# EAGLE design PiButtons7 (EAGLE 6.4)
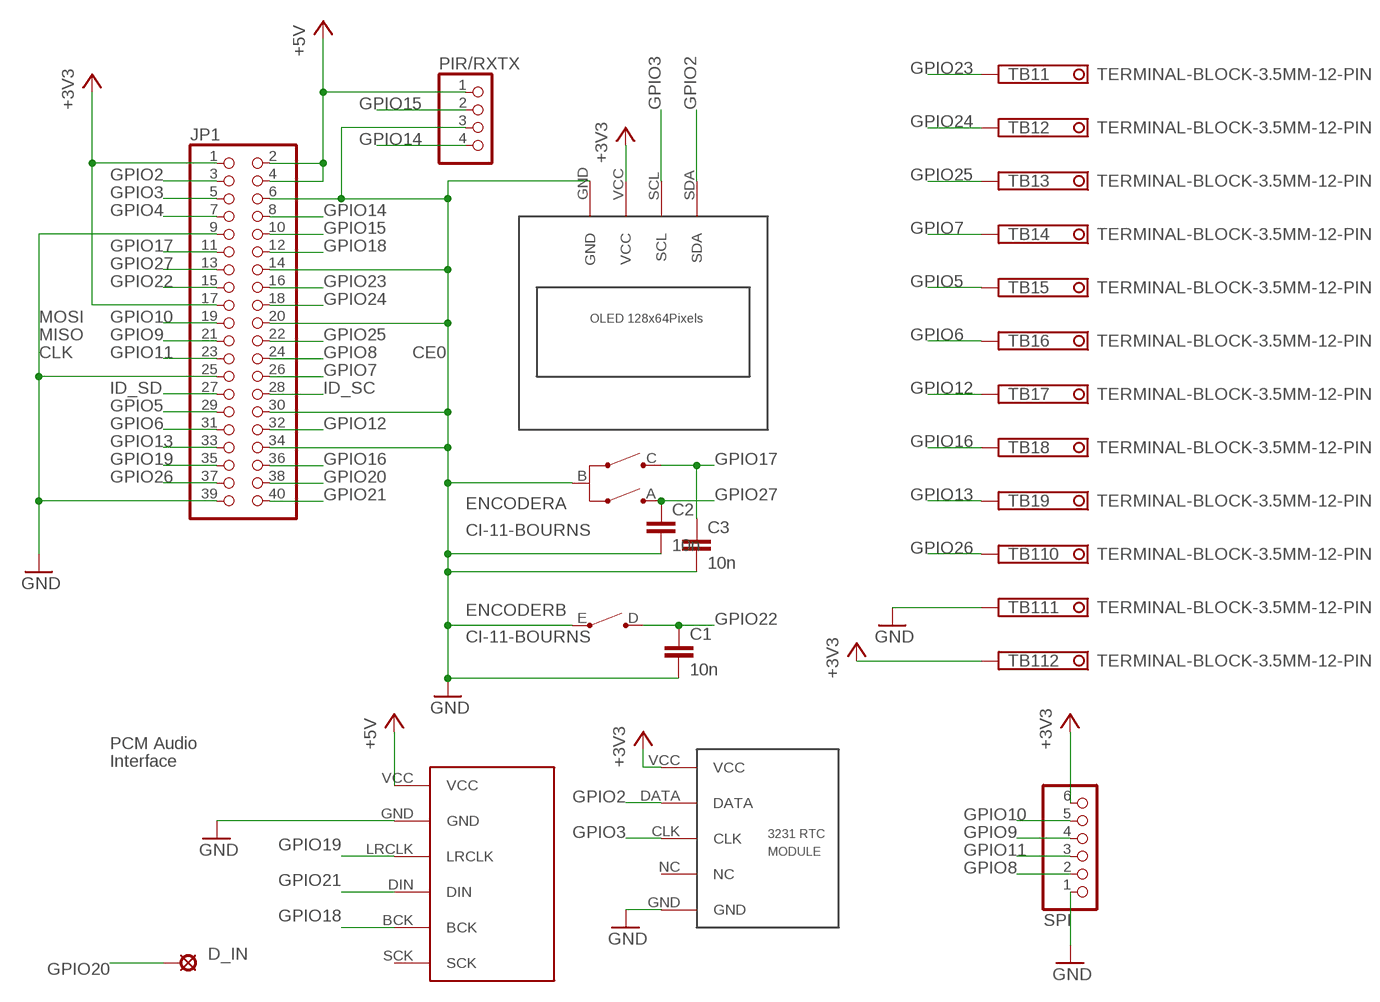
[diagram p0: schematic, sheet 1]

## Parts
C1  10n  C-EU050-025X075  [C050-025X075]
C2  10n  C-EU050-025X075  [C050-025X075]
C3  10n  C-EU050-025X075  [C050-025X075]
D_IN  LSP10  [LSP10]
ENCODER  CI-11-BOURNS  CI-11BOURNS  [CI-11]
JP1  PINHD-2X20  [2X20]
PIR/RXTX  PINHD-1X4  [1X04]
SPI  PINHD-1X6  [1X06]
TB1  TERMINAL-BLOCK-3.5MM-12-PIN  [TERMINAL-BLOCK-12-PIN-3.5MM-LONG-PAD]
U$1  PCM5102CARDPCB  [PCM5102CARD]
U$2  OLEDI2CDISPLAY  [OLEDI2C]
U$3  RTC3231PCB  [RTC3231PCB]

## Nets
+3V3: JP1.1 JP1.17 SPI.6 TB1.12 U$2.VCC U$3.VCC
+5V: JP1.2 JP1.4 PIR/RXTX.1 U$1.VCC
GND: C1.2 C2.2 C3.2 ENCODER.B(A:C) ENCODER.E(B:E) JP1.6 JP1.9 JP1.14 JP1.20 JP1.25 JP1.30 JP1.34 JP1.39 PIR/RXTX.3 SPI.1 TB1.11 U$1.GND U$2.GND U$3.GND
GPIO2: JP1.3 U$2.SDA U$3.DATA
GPIO3: JP1.5 U$2.SCL U$3.CLK
GPIO4: JP1.7
GPIO5: JP1.29 TB1.5
GPIO6: JP1.31 TB1.6
GPIO7: JP1.26 TB1.4
GPIO8: JP1.24 SPI.2
GPIO9: JP1.21 SPI.4
GPIO10: JP1.19 SPI.5
GPIO11: JP1.23 SPI.3
GPIO12: JP1.32 TB1.7
GPIO13: JP1.33 TB1.9
GPIO14: JP1.8 PIR/RXTX.4
GPIO15: JP1.10 PIR/RXTX.2
GPIO16: JP1.36 TB1.8
GPIO17: C3.1 ENCODER.C(A:B) JP1.11
GPIO18: JP1.12 U$1.BCK
GPIO19: JP1.35 U$1.LRCLK
GPIO20: D_IN.MP JP1.38
GPIO21: JP1.40 U$1.DIN
GPIO22: C1.1 ENCODER.D(B:D) JP1.15
GPIO23: JP1.16 TB1.1
GPIO24: JP1.18 TB1.2
GPIO25: JP1.22 TB1.3
GPIO26: JP1.37 TB1.10
GPIO27: C2.1 ENCODER.A(A:A) JP1.13
ID_SC: JP1.28
ID_SD: JP1.27
Unconnected: U$1.SCK U$3.NC

## Notes on the sheet
- MOSI
- MISO
- CLK | CE0
- PCM Audio
- Interface

## Library data of the parts
C1-C3 = resistor:C-EU: CAPACITOR, European symbol
D_IN = solpad:LSP10: SOLDER PAD drill 1.0 mm, distributor Buerklin, 12H555
ENCODER = piher:CI-11: 11mm Incemental Encoder Source: www.piher.net .. 04-CI-11v04.pdf
JP1 = pinhead:PINHD-2X20: PIN HEADER
PIR/RXTX = pinhead:PINHD-1X4: PIN HEADER
SPI = pinhead:PINHD-1X6: PIN HEADER
TB1 = Rembrandt Electronics - Terminal Block 3-5mm v1-0:TERMINAL-BLOCK-3.5MM-12-PIN
U$1 = special:PCM5102CARD
U$2 = special:OLEDI2C
U$3 = special:RTC3231PCB

## Board
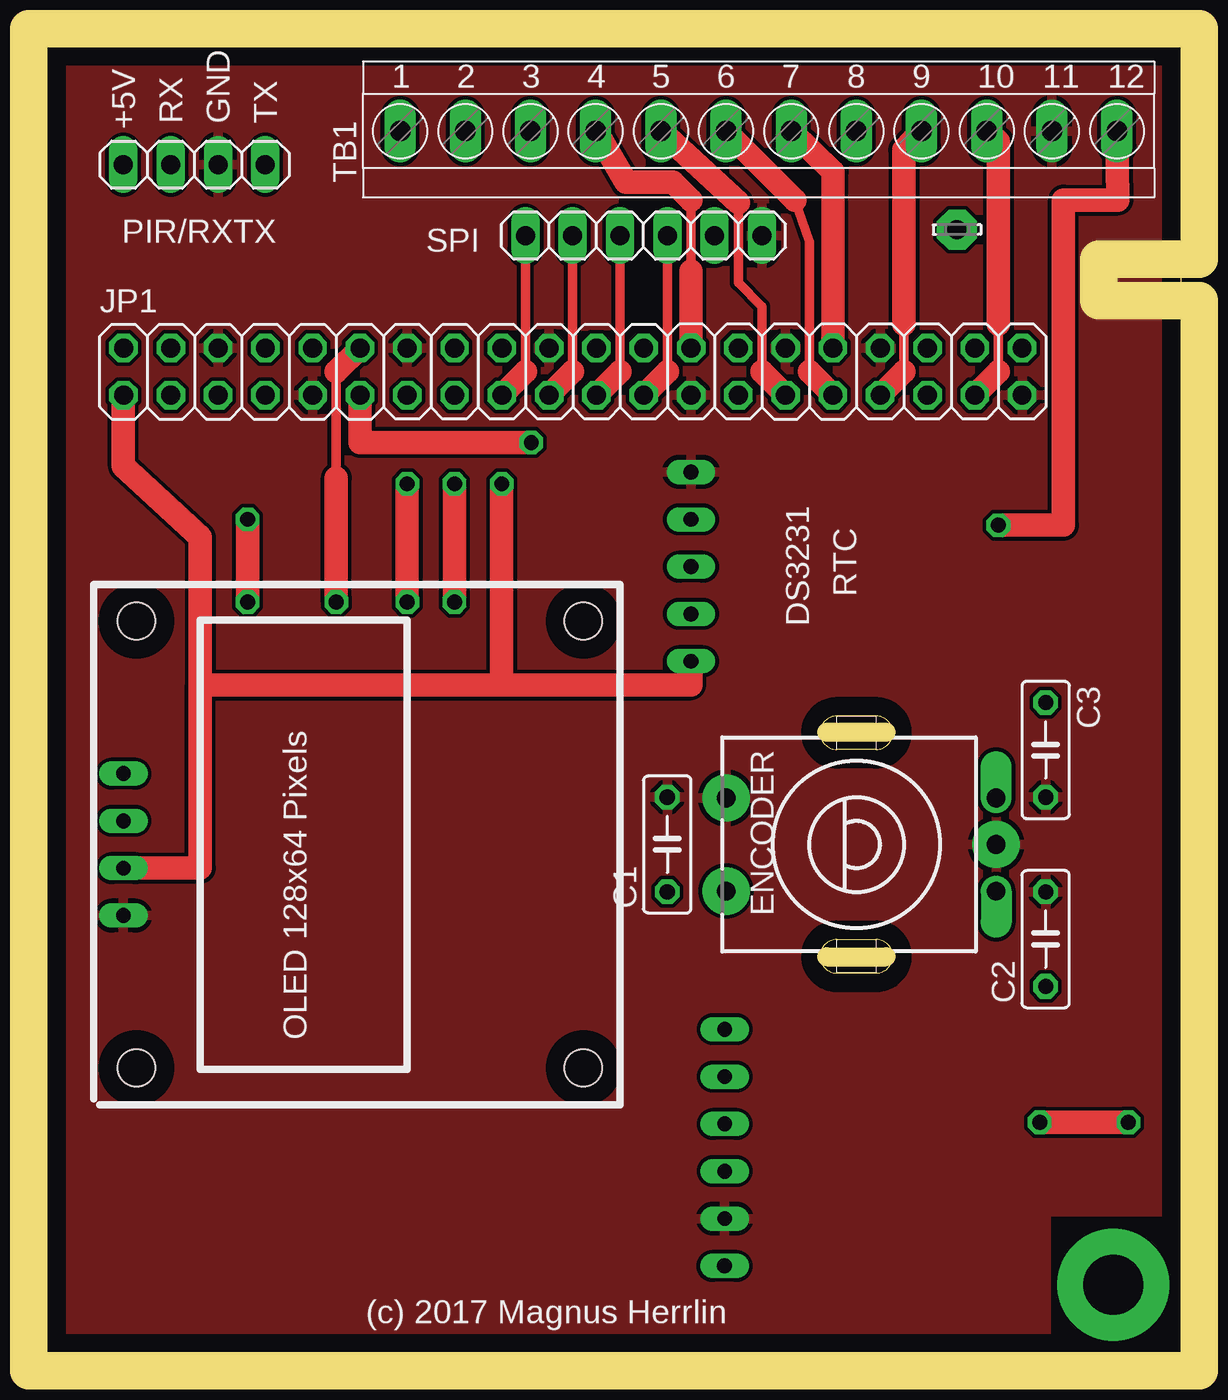
[diagram p1: board, top side]
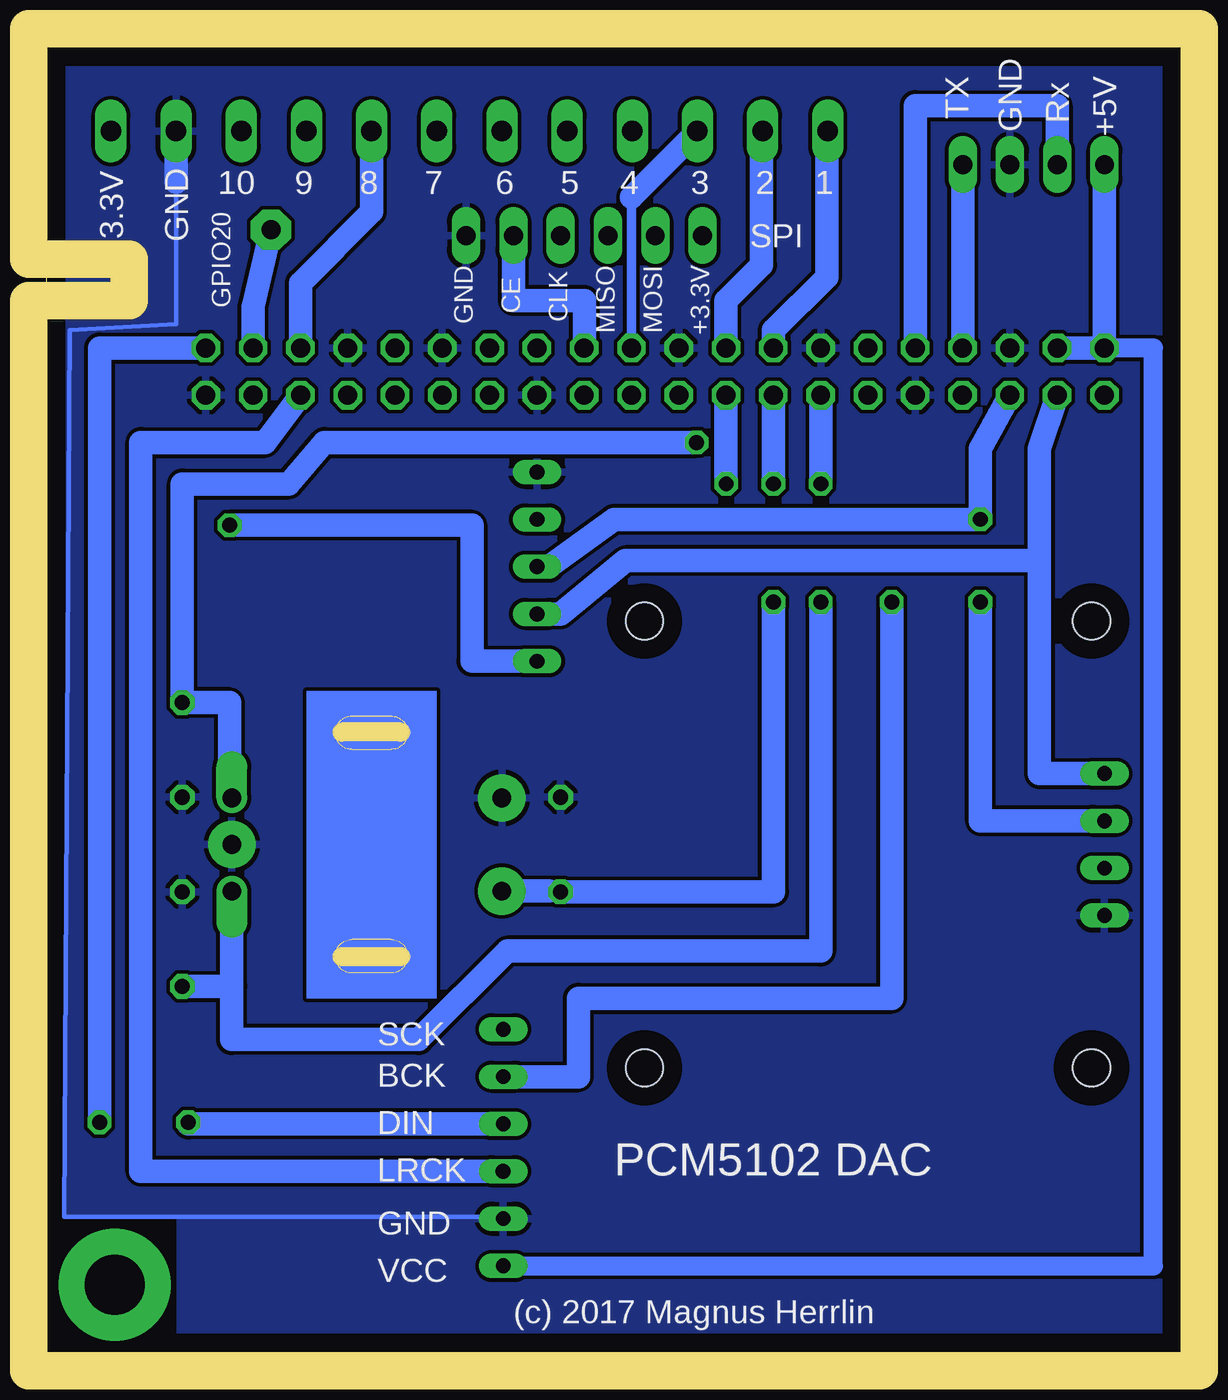
[diagram p2: board, bottom side, seen from below]

Size 60.95 x 70.16 mm. Coordinates in mm from the lower left corner, seen from the top.
Outline: 0,0 60.95,0 60.95,70.16 0,70.16 0,0
Copper layers (1*16): Top 0.035mm / dielectric 1.5mm / Bottom 0.035mm
Design rules "default": minimum track width 10mil, minimum drill 24mil, track to track 8mil, track to pad 8mil, pad to pad 8mil, via to via 8mil, smd to smd 8mil, copper to edge 40mil, drill to drill 8mil, minimum pad ring 10mil, minimum via ring 8mil, stop-mask expansion 4mil, vias tented up to drill 0mil, thermal gap 10mil
tRestrict: area 54,0.3 to 61,7.3
bRestrict: area 54,0.3 to 61,7.3
Milling: 10 lines

### Footprints (pad centres in the part's own frame; a part is rotated, then mirrored left to right if it is on the bottom)
C050-025X075 = drill 0.813 octagon: 1 -2.54,0; 2 2.54,0
LSP10 = drill 1.016 pad 2.159 octagon: MP 0,0
CI-11 = drill 1 pad 1.676 offset: A -2.5,-7.5; C 2.5,-7.5 | drill 1 pad 2.54: B 0,-7.5; D -2.5,7; E 2.5,7
2X20 = drill 1.016 octagon: 1 -24.13,-1.27; 2 -24.13,1.27; 3 -21.59,-1.27; 4 -21.59,1.27; 5 -19.05,-1.27; 6 -19.05,1.27; 7 -16.51,-1.27; 8 -16.51,1.27; 9 -13.97,-1.27; 10 -13.97,1.27; 11 -11.43,-1.27; 12 -11.43,1.27; 13 -8.89,-1.27; 14 -8.89,1.27; 15 -6.35,-1.27; 16 -6.35,1.27; 17 -3.81,-1.27; 18 -3.81,1.27; 19 -1.27,-1.27; 20 -1.27,1.27; 21 1.27,-1.27; 22 1.27,1.27; 23 3.81,-1.27; 24 3.81,1.27; 25 6.35,-1.27; 26 6.35,1.27; 27 8.89,-1.27; 28 8.89,1.27; 29 11.43,-1.27; 30 11.43,1.27; 31 13.97,-1.27; 32 13.97,1.27; 33 16.51,-1.27; 34 16.51,1.27; 35 19.05,-1.27; 36 19.05,1.27; 37 21.59,-1.27; 38 21.59,1.27; 39 24.13,-1.27; 40 24.13,1.27
1X04 = drill 1.016 long: 1 -3.81,0; 2 -1.27,0; 3 1.27,0; 4 3.81,0
1X06 = drill 1.016 long: 1 -6.35,0; 2 -3.81,0; 3 -1.27,0; 4 1.27,0; 5 3.81,0; 6 6.35,0
TERMINAL-BLOCK-12-PIN-3.5MM-LONG-PAD = drill 1.1 pad 1.7 long: 1 -17.496,-0.004; 2 -13.996,-0.004; 3 -10.496,-0.004; 4 -6.996,-0.004; 5 -3.496,-0.004; 6 0.004,-0.004; 7 3.504,-0.004; 8 7.004,-0.004; 9 10.504,-0.004; 10 14.004,-0.004; 11 17.504,-0.004; 12 21.004,-0.004
PCM5102CARD = drill 0.8 long: BCK 30.069,14.204; DIN 30.069,11.664; GND 30.069,6.581; LRCLK 30.071,9.121; SCK 30.069,16.744; VCC 30.066,4.041
OLEDI2C = drill 0.8 long: GND -3.81,12.7; SCL 1.27,12.7; SDA 3.81,12.7; VCC -1.27,12.7 | hole 2: -12,12; 12,12; -12,-12; 12,-12
RTC3231PCB = drill 0.8 long: CLK 0,0; DATA 0,2.54; GND 0,-5.08; NC 0,-2.54; VCC 0,5.08

### Placement (x,y rotation side)
C1  33.34,27.3 90 top
C2  53.66,22.23 90 top
C3  53.66,32.38 270 top
D_IN  48.9,60.33 0 top
ENCODER  43.5,27.3 90 top
JP1  28.26,52.7 0 top
PIR/RXTX  7.94,63.82 0 top
SPI  32.07,60.01 180 top
TB1  36.49,65.62 0 top
U$1  6.35,0.64 0 top
U$2  16.83,27.3 90 top
U$3  34.61,42.23 180 top

### Tracks (layer width: path | path; a pad name or v marks a point on that pad's centre or on a via)
+3V3  (via drill 0.8 pad 1.27)
  Top 0.5: 25.72,52.7 SPI.6 | JP1.1
  Top 1.27: JP1.17 25.72,52.7 | U$2.VCC 8.26,26.04 8.26,35.88 | JP1.1 4.13,47.62 8.26,43.81 8.26,35.88 | 8.26,35.88 24.45,35.88 | 24.45,35.88 34.61,35.88 U$3.VCC | v51.12,44.45 54.61,44.45 54.61,61.91 57.54,61.91 TB1.12 | v24.45,46.67 24.45,35.88
  Bottom 0.5: JP1.1 | JP1.17
  Bottom 1.27: JP1.17 v24.45,46.67 | U$3.VCC 38.1,37.15 38.1,44.45 v51.12,44.45
+5V
  Bottom 0.5: JP1.2
  Bottom 1.016: U$1.VCC 1.5,4.68 1.5,53.98 JP1.2
  Bottom 1.27: JP1.4 JP1.2 | JP1.2 PIR/RXTX.1
GND
  Bottom 0.254: 53.98,62.87 53.98,55.24 59.69,54.93 60.01,7.3 36.2,7.3 36.4,7.21 U$1.GND
  Bottom 1.27: TB1.11 53.98,65.72 53.98,62.87
  pour Bottom: -2.86,-4.45 68.26,-4.45 68.26,74.3 -2.86,74.3
  pour Top: -2.86,-4.45 68.26,-4.13 68.26,74.3 -2.86,73.98
GPIO2
  Bottom 1.27: 7.62,42.55 7.62,31.11 U$2.SDA | JP1.3 7.62,48.58 7.62,42.55 | 7.62,42.55 29.84,42.55 33.34,39.69 U$3.DATA
GPIO3  (via drill 0.8 pad 1.27)
  Top 1.27: v10.79,40.32 v10.79,44.77
  Bottom 0.5: JP1.5
  Bottom 1.27: JP1.5 10.79,48.58 v10.79,44.77 30.48,44.77 33.97,42.23 U$3.CLK | U$2.SCL 10.79,28.57 v10.79,40.32
GPIO5
  Top 0.5: JP1.29 | 38.42,52.7 38.42,56.2 37.15,57.47 37.15,61.78
  Top 1.27: JP1.29 38.42,52.7 | TB1.5 37.15,61.78
GPIO6
  Top 0.5: JP1.31 | 40.96,52.7 40.96,59.69 40.2,61.91
  Top 1.27: JP1.31 40.96,52.7 | TB1.6 40.2,61.91
GPIO7
  Top 0.5: 34.61,58.1 34.61,61.91
  Top 1.27: 34.61,61.91 33.66,62.87 31.11,62.87 29.53,65.58 TB1.4 | JP1.26 34.61,58.1
GPIO8
  Bottom 0.5: JP1.24
  Bottom 1.27: JP1.24 32.07,56.52 35.88,56.52 SPI.2
GPIO9
  Top 0.5: 30.8,52.7 SPI.4
  Top 1.27: JP1.21 30.8,52.7
GPIO10
  Top 0.5: 28.26,52.7 SPI.5
  Top 1.27: JP1.19 28.26,52.7
GPIO11
  Top 0.5: 33.34,52.7 SPI.3
  Top 1.27: JP1.23 33.34,52.7
GPIO12
  Top 1.27: JP1.32 42.23,63.43 TB1.7
GPIO13
  Top 0.5: JP1.33 | 46.04,55.24 46.04,52.7
  Top 1.27: JP1.33 46.04,52.7 | 46.04,55.24 46.04,64.62 TB1.9
GPIO14
  Bottom 0.5: JP1.8
  Bottom 1.27: JP1.8 PIR/RXTX.4
GPIO15
  Bottom 0.5: 14.29,66.99
  Bottom 1.27: JP1.10 14.29,66.99 | 14.29,66.99 6.67,66.99 PIR/RXTX.2
GPIO16
  Bottom 1.27: JP1.36 47.31,57.46 43.5,61.28 43.5,65.58 TB1.8
GPIO17  (via drill 0.8 pad 1.27)
  Top 1.27: v26.04,48.9 16.83,48.9 JP1.11
  Bottom 0.5: ENCODER.C 51.12,29.8
  Bottom 1.27: 51.12,29.8 51.12,34.92 C3.1 53.66,46.67 47.94,46.67 46.04,48.9 v26.04,48.9
GPIO18  (via drill 0.8 pad 1.27)
  Top 0.5: 15.56,46.99 15.56,52.7
  Top 1.27: 15.56,52.7 JP1.12 | v15.56,40.32 15.56,46.99
  Bottom 1.27: U$1.BCK 32.38,14.84 32.38,19.05 15.56,19.05 v15.56,40.32
GPIO19
  Bottom 1.27: U$1.LRCLK 55.88,9.76 55.88,48.9 49.22,48.9 JP1.35
GPIO20
  Bottom 1.27: JP1.38 49.85,56.19 D_IN.MP
GPIO21  (via drill 0.8 pad 1.27)
  Top 1.27: v53.34,12.38 v58.1,12.38
  Bottom 0.5: JP1.40
  Bottom 1.27: U$1.DIN 53.34,12.3 v53.34,12.38 | v58.1,12.38 58.1,53.98 JP1.40
GPIO22  (via drill 0.8 pad 1.27)
  Top 1.27: v21.91,40.32 v21.91,46.67
  Bottom 0.5: 33.97,24.8 C1.1
  Bottom 1.27: ENCODER.D 33.97,24.8 | C1.1 21.91,24.77 v21.91,40.32 | v21.91,46.67 21.91,47.94 JP1.15
GPIO23
  Bottom 1.27: JP1.16 21.91,54.92 19.05,57.78 19.05,65.09 | 19.05,65.09 19.05,65.56 | TB1.1 19.05,65.09
GPIO24
  Bottom 1.27: JP1.18 24.45,56.51 22.54,58.42 22.54,65.09 | 22.54,65.09 22.54,65.57 | TB1.2 22.54,65.09
GPIO25
  Bottom 0.5: JP1.22 29.53,62.08
  Bottom 1.27: TB1.3 29.53,62.08
GPIO26
  Top 0.5: JP1.37 | 51.12,55.24 51.12,52.7
  Top 1.27: JP1.37 51.12,52.7 | 51.12,55.24 51.12,65.05 TB1.10
GPIO27  (via drill 0.8 pad 1.27)
  Top 1.27: v19.37,46.67 v19.37,40.32
  Bottom 0.5: 51.02,19.68 51,19.68 | JP1.13
  Bottom 1.27: C2.1 51.02,19.68 51.02,16.83 40.96,16.83 36.2,21.59 19.37,21.59 v19.37,40.32 | 51,19.68 ENCODER.A | JP1.13 v19.37,46.67
N$19  (via drill 3.2 pad 6)
  other vias: 57.29,3.66
(copper drawn outside any net)
  shapes: Bottom area x1

### Text on the board
tNames: +5V | RX | GND | TX | RTC | DS3231 | OLED 128x64 Pixels | (c) 2017 Magnus Herrlin
bNames: GND | +5V | TX | Rx | +3.3V | 1 | 2 | 3 | 4 | 5 | 6 | 7 | 8 | 9 | 10 | GPIO20 | GND | SPI | +3.3V | MOSI | MISO | CLK | CE | GND | SCK | BCK | DIN | PCM5102 DAC | LRCK | GND | VCC | (c) 2017 Magnus Herrlin